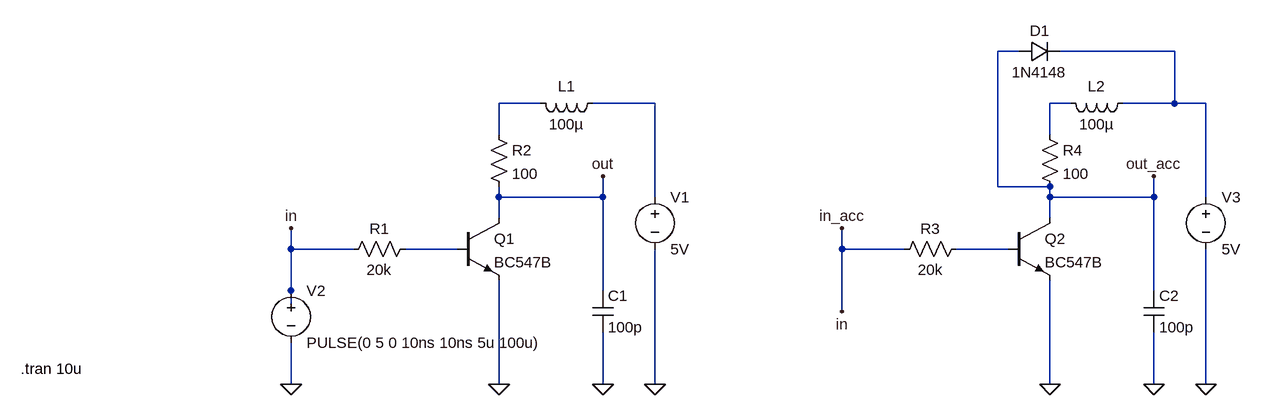
[diagram p0: schematic Lab3.asc]
Lab3.asc, the LTspice schematic file:
Version 4
SHEET 1 1368 680
WIRE 1024 -48 992 -48
WIRE 1264 -48 1088 -48
WIRE 288 32 224 32
WIRE 464 32 368 32
WIRE 1104 32 1072 32
WIRE 1264 32 1264 -48
WIRE 1264 32 1184 32
WIRE 1312 32 1264 32
WIRE 224 80 224 32
WIRE 1072 80 1072 32
WIRE 992 160 992 -48
WIRE 1072 160 992 160
WIRE 224 176 224 160
WIRE 384 176 384 144
WIRE 384 176 224 176
WIRE 464 176 464 32
WIRE 1072 176 1072 160
WIRE 1232 176 1232 144
WIRE 1232 176 1072 176
WIRE 1312 176 1312 32
WIRE 224 208 224 176
WIRE 1072 208 1072 176
WIRE -96 256 -96 224
WIRE 0 256 -96 256
WIRE 160 256 80 256
WIRE 752 256 752 224
WIRE 848 256 752 256
WIRE 1008 256 928 256
WIRE -96 320 -96 256
WIRE 384 320 384 176
WIRE 1232 320 1232 176
WIRE -96 352 -96 320
WIRE 752 352 752 256
WIRE -96 464 -96 400
WIRE 224 464 224 304
WIRE 384 464 384 384
WIRE 464 464 464 256
WIRE 1072 464 1072 304
WIRE 1232 464 1232 384
WIRE 1312 464 1312 256
FLAG -96 464 0
FLAG 224 464 0
FLAG 464 464 0
FLAG 384 464 0
FLAG -96 224 in
FLAG 384 144 out
FLAG 1072 464 0
FLAG 1312 464 0
FLAG 1232 464 0
FLAG 752 224 in_acc
FLAG 1232 144 out_acc
FLAG 752 352 in
SYMBOL voltage 464 160 R0
WINDOW 123 0 0 Left 0
WINDOW 39 0 0 Left 0
SYMATTR InstName V1
SYMATTR Value 5V
SYMBOL res 208 64 R0
SYMATTR InstName R2
SYMATTR Value 100
SYMBOL npn 160 208 R0
SYMATTR InstName Q1
SYMATTR Value BC547B
SYMBOL res 96 240 R90
WINDOW 0 0 56 VBottom 2
WINDOW 3 32 56 VTop 2
SYMATTR InstName R1
SYMATTR Value 20k
SYMBOL voltage -96 304 R0
WINDOW 123 0 0 Left 0
WINDOW 39 0 0 Left 0
SYMATTR InstName V2
SYMATTR Value PULSE(0 5 0 10ns 10ns 5u 100u)
SYMBOL cap 368 320 R0
SYMATTR InstName C1
SYMATTR Value 100p
SYMBOL voltage 1312 160 R0
WINDOW 123 0 0 Left 0
WINDOW 39 0 0 Left 0
SYMATTR InstName V3
SYMATTR Value 5V
SYMBOL res 1056 64 R0
SYMATTR InstName R4
SYMATTR Value 100
SYMBOL npn 1008 208 R0
SYMATTR InstName Q2
SYMATTR Value BC547B
SYMBOL res 944 240 R90
WINDOW 0 0 56 VBottom 2
WINDOW 3 32 56 VTop 2
SYMATTR InstName R3
SYMATTR Value 20k
SYMBOL cap 1216 320 R0
SYMATTR InstName C2
SYMATTR Value 100p
SYMBOL ind 384 16 R90
WINDOW 0 5 56 VBottom 2
WINDOW 3 32 56 VTop 2
SYMATTR InstName L1
SYMATTR Value 100µ
SYMBOL ind 1200 16 R90
WINDOW 0 5 56 VBottom 2
WINDOW 3 32 56 VTop 2
SYMATTR InstName L2
SYMATTR Value 100µ
SYMBOL diode 1024 -32 R270
WINDOW 0 32 32 VTop 2
WINDOW 3 0 32 VBottom 2
SYMATTR InstName D1
SYMATTR Value 1N4148
TEXT -512 440 Left 2 !.tran 10u

The netlist it stands for:
* Lab3.asc
V1 N003 0 5V
R2 N002 out 100
Q1 out N005 0 0 BC547B
R1 N005 in_acc 20k
V2 in_acc 0 PULSE(0 5 0 10ns 10ns 5u 100u)
C1 out 0 100p
V3 N001 0 5V
R4 N004 out_acc 100
Q2 out_acc N006 0 0 BC547B
R3 N006 in_acc 20k
C2 out_acc 0 100p
L1 N003 N002 100µ
L2 N001 N004 100µ
D1 out_acc N001 1N4148
.model D D
.lib standard.dio
.model NPN NPN
.model PNP PNP
.lib standard.bjt
.tran 10u
.backanno
.end